# EAGLE design LumiDrive (EAGLE 9.2.1)
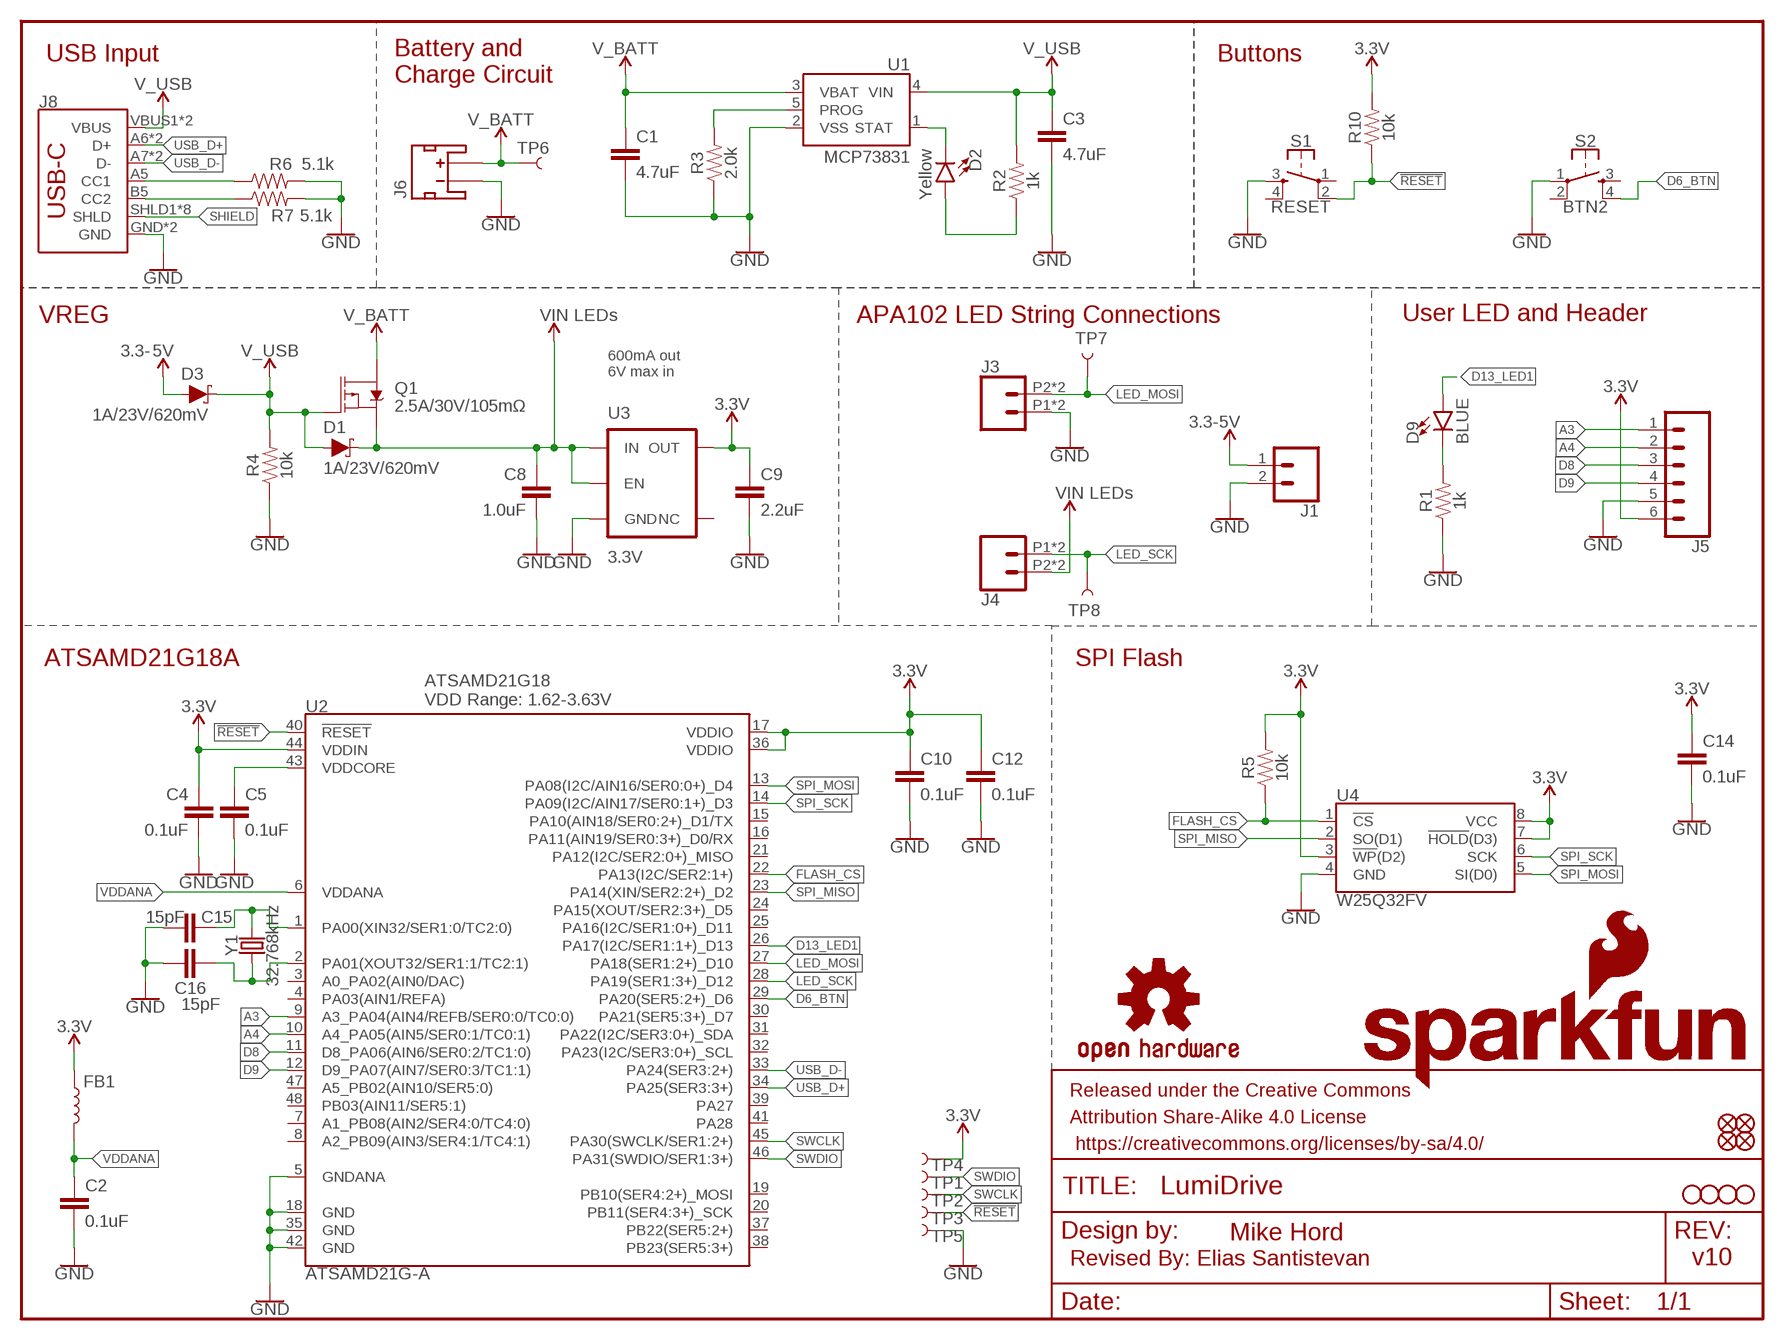
[diagram p0: schematic, sheet 1]

## Parts
C1  4.7uF  4.7UF-0603-6.3V-(10%)  [0603]
C2  0.1uF  0.1UF-0603-25V-(+80/-20%)  [0603]
C3  4.7uF  4.7UF-0603-6.3V-(10%)  [0603]
C4  0.1uF  0.1UF-0603-25V-(+80/-20%)  [0603]
C5  0.1uF  0.1UF-0603-25V-(+80/-20%)  [0603]
C8  1.0uF  1.0UF-0805-25V-10%  [0805]
C9  2.2uF  2.2UF-0603-10V-20%  [0603]
C10  0.1uF  0.1UF-0603-25V-(+80/-20%)  [0603]
C12  0.1uF  0.1UF-0603-25V-(+80/-20%)  [0603]
C14  0.1uF  0.1UF-0603-25V-(+80/-20%)  [0603]
C15  15pF  15PF-0603-50V-5%  [0603]
C16  15pF  15PF-0603-50V-5%  [0603]
D1  1A/23V/620mV  DIODE-SCHOTTKY-BAT20J  [SOD-323]
D2  Yellow  LED-YELLOW0603  [LED-0603]
D3  1A/23V/620mV  DIODE-SCHOTTKY-BAT20J  [SOD-323]
D9  BLUE  LED-BLUE0603  [LED-0603]
FB1  30Ω/1.8A  INDUCTORFB-30OHM  [0603]
FD1  FIDUCIALUFIDUCIAL  [FIDUCIAL-MICRO]
FD2  FIDUCIALUFIDUCIAL  [FIDUCIAL-MICRO]
FD3  FIDUCIALUFIDUCIAL  [FIDUCIAL-MICRO]
FD4  FIDUCIALUFIDUCIAL  [FIDUCIAL-MICRO]
FRAME1  FRAME-LETTER  [CREATIVE_COMMONS]
H1  STAND-OFF  [STAND-OFF]
H2  STAND-OFF  [STAND-OFF]
H3  STAND-OFF  [STAND-OFF]
H4  STAND-OFF  [STAND-OFF]
J1  CONN_021X02_NO_SILK  [1X02_NO_SILK]
J3  CONN_02SMALL_POKEHOME  [1X02_POKEHOME]
J4  CONN_02SMALL_POKEHOME  [1X02_POKEHOME]
J5  CONN_06NO_SILK_FEMALE_PTH  [1X06_NO_SILK]
J6  JST_2MM_MALE  [JST-2-SMD]
J8  USB_C16PIN  [USB-C-16P]
LOGO1  OSHW-LOGOM  [OSHW-LOGO-M]
LOGO3  SFE_LOGO_NAME_FLAME.2_INCH  [SFE_LOGO_NAME_FLAME_.2]
Q1  2.5A/30V/105mΩ  MOSFET_PCH-DMG2307L  [SOT23-3]
R1  1k  1KOHM-0603-1/10W-1%  [0603]
R2  1k  1KOHM-0603-1/10W-1%  [0603]
R3  2.0k  2.0KOHM-0603-1/10W-5%  [0603]
R4  10k  10KOHM-0603-1/10W-1%  [0603]
R5  10k  10KOHM-0603-1/10W-1%  [0603]
R6  5.1k  5.1KOHM5.1KOHM-0603-1/10W-1%  [0603]
R7  5.1k  5.1KOHM5.1KOHM-0603-1/10W-1%  [0603]
R10  10k  10KOHM-0603-1/10W-1%  [0603]
S1  RESET  MOMENTARY-SWITCH-SPST-2-SMD-4.6X2.8MM  [TACTILE_SWITCH_SMD_4.6X2.8MM]
S2  BTN2  MOMENTARY-SWITCH-SPST-2-SMD-4.6X2.8MM  [TACTILE_SWITCH_SMD_4.6X2.8MM]
TP1  TP-SWDIO  TEST-POINT3X5  [PAD.03X.05]
TP2  TP-SWCLK  TEST-POINT3X5  [PAD.03X.05]
TP3  TP-!RESET!  TEST-POINT3X5  [PAD.03X.05]
TP4  TP-3.3V  TEST-POINT3X5  [PAD.03X.05]
TP5  TP-GND  TEST-POINT3X5  [PAD.03X.05]
TP6  TEST-POINT3X4  [PAD.03X.04]
TP7  TEST-POINT3X4  [PAD.03X.04]
TP8  TEST-POINT3X4  [PAD.03X.04]
U1  MCP73831  [SOT23-5]
U2  ATSAMD21G-A  [TQFP-48]
U3  3.3V  V_REG_AP2112K-3.3V  [SOT23-5]
U4  W25Q32FV  W25Q32FVSS  [SOIC-8]
Y1  32.768kHz  CRYSTAL-32.768KHZSMD-3.2X1.5  [CRYSTAL-SMD-3.2X1.5MM]

## Nets
3.3V: C4.1 C9.1 C10.1 C12.1 C14.1 FB1.1 J5.6 R5.2 R10.2 TP4.P$1 U2.17(VDDIO) U2.36(VDDIO) U2.44(VDDIN) U3.5(OUT) U4.3(!WP!(D2)) U4.7(!HOLD!(D3)) U4.8(VCC)
5V: D3.A J1.1
!RESET: R10.1 S1.2 TP3.P$1 U2.40(!RESET!)
A3: J5.1 U2.9(A3_PA04(AIN4/REFB/SER0:0/TC0:0))
A4: J5.2 U2.10(A4_PA05(AIN5/SER0:1/TC0:1))
D6_BTN: S2.4 U2.29(PA20(SER5:2+)_D6)
D8: J5.3 U2.11(D8_PA06(AIN6/SER0:2/TC1:0))
D9: J5.4 U2.12(D9_PA07(AIN7/SER0:3/TC1:1))
D13_LED1: D9.A U2.26(PA17(I2C/SER1:1+)_D13)
FLASH_CS: R5.1 U2.22(PA13(I2C/SER2:1+)) U4.1(!CS!)
GND: C1.2 C2.2 C3.2 C4.2 C5.2 C8.2 C9.2 C10.2 C12.2 C14.2 C15.1 C16.1 J1.2 J3.P1 J3.P3 J5.5 J6.1(-) J8.GND J8.GND2(GND) R1.1 R3.1 R4.1 R6.2 R7.2 S1.3 S2.1 TP5.P$1 U1.2(VSS) U2.5(GNDANA) U2.18(GND) U2.35(GND) U2.42(GND) U3.2(GND) U4.4(GND)
LED_MOSI: J3.P2 J3.P4 TP7.P$1 U2.27(PA18(SER1:2+)_D10)
LED_SCK: J4.P1 J4.P3 TP8.P$1 U2.28(PA19(SER1:3+)_D12)
N$1: D9.C R1.2
N$2: C15.2 U2.1(PA00(XIN32/SER1:0/TC2:0)) Y1.P$2
N$3: C16.2 U2.2(PA01(XOUT32/SER1:1/TC2:1)) Y1.P$1
N$4: D2.A R2.1
N$5: J8.B5(CC2) R7.1
N$6: J8.A5(CC1) R6.1
N$7: D2.C U1.1(STAT)
N$9: R3.2 U1.5(PROG)
SHIELD: J8.SHLD1(SHLD) J8.SHLD2(SHLD) J8.SHLD3(SHLD) J8.SHLD4(SHLD) J8.SHLD5(SHLD) J8.SHLD6(SHLD) J8.SHLD7(SHLD) J8.SHLD8(SHLD)
SPI_MISO: U2.23(PA14(XIN/SER2:2+)_D2) U4.2(SO(D1))
SPI_MOSI: U2.13(PA08(I2C/AIN16/SER0:0+)_D4) U4.5(SI(D0))
SPI_SCK: U2.14(PA09(I2C/AIN17/SER0:1+)_D3) U4.6(SCK)
SWCLK: TP2.P$1 U2.45(PA30(SWCLK/SER1:2+))
SWDIO: TP1.P$1 U2.46(PA31(SWDIO/SER1:3+))
USB_D+: J8.A6(D+) J8.B6(D+) U2.34(PA25(SER3:3+))
USB_D-: J8.A7(D-) J8.B7(D-) U2.33(PA24(SER3:2+))
V_BATT: C1.1 J6.2(+) Q1.3(D) TP6.P$1 U1.3(VBAT)
V_USB: C3.1 D1.A D3.C J8.VBUS1(VBUS) J8.VBUS2(VBUS) Q1.1(G) R2.2 R4.2 U1.4(VIN)
VDDANA: C2.1 FB1.2 U2.6(VDDANA)
VDDCORE: C5.1 U2.43(VDDCORE)
VIN: C8.1 D1.C J4.P2 J4.P4 Q1.2(S) U3.1(IN) U3.3(EN)
Unconnected: J6.NC1(PAD1) J6.NC2(PAD2) S1.1 S1.4 S2.2 S2.3 U2.3(A0_PA02(AIN0/DAC)) U2.4(PA03(AIN1/REFA)) U2.7(A1_PB08(AIN2/SER4:0/TC4:0)) U2.8(A2_PB09(AIN3/SER4:1/TC4:1)) U2.15(PA10(AIN18/SER0:2+)_D1/TX) U2.16(PA11(AIN19/SER0:3+)_D0/RX) U2.19(PB10(SER4:2+)_MOSI) U2.20(PB11(SER4:3+)_SCK) U2.21(PA12(I2C/SER2:0+)_MISO) U2.24(PA15(XOUT/SER2:3+)_D5) U2.25(PA16(I2C/SER1:0+)_D11) U2.30(PA21(SER5:3+)_D7) U2.31(PA22(I2C/SER3:0+)_SDA) U2.32(PA23(I2C/SER3:0+)_SCL) U2.37(PB22(SER5:2+)) U2.38(PB23(SER5:3+)) U2.39(PA27) U2.41(PA28) U2.47(A5_PB02(AIN10/SER5:0)) U2.48(PB03(AIN11/SER5:1)) U3.4(NC)

## Notes on the sheet
- Battery and
  Charge Circuit
- USB Input | Buttons
- VREG | APA102 LED String Connections | User LED and Header
- LEDs
- 3.3-
- 600mA out
  6V max in
- 3.3-
- LEDs
- ATSAMD21G18A | SPI Flash
- ATSAMD21G18
  VDD Range: 1.62-3.63V
- Mike Hord
- v10
- Revised By: Elias Santistevan

## Library data of the parts
C1 C3 = SparkFun-Capacitors:4.7UF: 4.7µF ceramic capacitors A capacitor is a passive two-terminal electrical component used to store electrical energy temporarily in an electric field.; PROD_ID: CAP-08280
C2 C4 C5 C10 C12 C14 = SparkFun-Capacitors:0.1UF: 0.1µF ceramic capacitors A capacitor is a passive two-terminal electrical component used to store electrical energy temporarily in an electric field.; PROD_ID: CAP-00810
C8 = SparkFun-Capacitors:1.0UF: 1µF ceramic capacitors A capacitor is a passive two-terminal electrical component used to store electrical energy temporarily in an electric field.; PROD_ID: CAP-08064
C9 = SparkFun-Capacitors:2.2UF: 2.2µF ceramic capacitors A capacitor is a passive two-terminal electrical component used to store electrical energy temporarily in an electric field.; PROD_ID: CAP-07888
C15 C16 = SparkFun-Capacitors:15PF: 15pF ceramic capacitors A capacitor is a passive two-terminal electrical component used to store electrical energy temporarily in an electric field.; PROD_ID: CAP-07881
D1 D3 = SparkFun-DiscreteSemi:DIODE-SCHOTTKY: Schottky diode A Schottky diode is a semiconductor diode which has a low forward voltage drop and a very fast switching action.; PROD_ID: DIO-11623
D2 = SparkFun-LED:LED-YELLOW: Yellow SMD LED Used in manufacturing several products at SparkFun. Packages: 0603 - SMD 0603 package[Product Link] <http://www.kingbrightusa.com/product.asp?catalog_name=LED&product_id=APT1608SYCK> 0603 -SMART - SMART SMD 0603 package (more efficient/more expensive) [Product Link] <http://www.osram-os.com/osram_os/en/products/product-catalog/led-light-emitting-diodes/smartled-0603/ly-l29k/index.jsp> LilyPad - SMD1206 package[Product Datasheet] <https://www.sparkfun.com/datasheets/DevTools/LilyPad/Q150YUS4.pdf> SparkFun Products: Blynk Board <https://www.sparkfun.com/products/13794> IOIO-OTG <https://www.sparkfun.com/products/13613> XBee Explorer Serial <https://www.sparkfun.com/products/13225>; PROD_ID: DIO-09003
D9 = SparkFun-LED:LED-BLUE: Blue SMD LED Used in manufacturing of various products at SparkFun Packages: 0603 - SMD 0603 package [Product Link] <http://www.digikey.com/product-detail/en/SMLE12BC7TT86/511-1589-2-ND/1641808> 1206 - SMD1206 package [Product Link] <http://www.digikey.com/product-detail/en/lite-on-inc/LTST-C150TBKT/160-1643-1-ND/573584> SparkFun Products: ESP8266 Thing-Dev Board <https://www.sparkfun.com/products/13711> RedBoard <https://www.sparkfun.com/products/12757>; PROD_ID: DIO-08575
FB1 = SparkFun-Coils:INDUCTOR: Inductors Resist changes in electrical current. Basically a coil of wire. SparkFun Products: SparkFun Load Cell Amplifier - HX711 <https://www.sparkfun.com/products/13879> IOIO-OTG - V2.2 <https://www.sparkfun.com/products/13613>; PROD_ID: NDUC-07859
FD1-FD4 = SparkFun-Aesthetics:FIDUCIAL: Fiducial Alignment Points Point-of-reference for pick-and-place machines and other optical instruments.
FRAME1 = SparkFun-Aesthetics:FRAME-LETTER: Schematic Frame - Letter Standard 8.5x11 US Letter frame
H1-H4 = SparkFun-Hardware:STAND-OFF: Stand Off Drill holes for mechanically mounting via screws, standoffs, etc. Note: Use the keepout ring to avoid running the screw head into surrounding components. Variant Overviews STAND-OFF - Mechanical footprint for a #4 phillips button head screw. STAND-OFF-TIGHT - Mechanical footprint for a #4 phillips button head screw, Example SparkFun Products Screw - Phillips Head (1/4", 4-40, 10 pack) <https://www.sparkfun.com/products/10453> (PRT-10453) Screw - Phillips Head (1/2", 4-40, 10 pack) <https://www.sparkfun.com/products/10452> (PRT-10452) Screw - Phillips Head (3/4", 4-40, 10 pack) <https://www.sparkfun.com/products/10451> (PRT-10451) Screw - Phillips Head (1", 4-40, 10 pack) <https://www.sparkfun.com/products/10450> (PRT-10450)
J1 = SparkFun-Connectors:CONN_02: Multi connection point. Often used as Generic Header-pin footprint for 0.1 inch spaced/style header connections On any of the 0.1 inch spaced packages, you can populate with these: Break Away Headers - Straight <https://www.sparkfun.com/products/116> (PRT-00116) Break Away Male Headers - Right Angle <https://www.sparkfun.com/products/553> (PRT-00553) Female Headers <https://www.sparkfun.com/products/115> (PRT-00115) Break Away Headers - Machine Pin <https://www.sparkfun.com/products/117> (PRT-00117) Break Away Female Headers - Swiss Machine Pin <https://www.sparkfun.com/products/743> (PRT-00743) For SCREWTERMINALS and SPRING TERMINALS visit here: Screw Terimnals on SparkFun.com <https://www.sparkfun.com/search/results?term=Screw+Terminals> (5mm/3.5mm/2.54mm spacing) This device is also useful as a general connection point to wire up your design to another part of your project. Our various solder wires solder well into these plated through hole pads. Hook-Up Wire - Assortment (Stranded, 22 AWG) <https://www.sparkfun.com/products/11375> (PRT-11375) Hook-Up Wire - Assortment (Solid Core, 22 AWG) <https://www.sparkfun.com/products/11367> (PRT-11367) View the entire wire category on our website here <https://www.sparkfun.com/categories/141> Special notes: Molex polarized connector foot print use with: PRT-08233 with associated crimp pins and housings. 2.54_SCREWTERM for use with PRT-10571. 3.5mm Screw Terminal footprints for PRT-08084 5mm Screw Terminal footprints for use with PRT-08432
J3 J4 = SparkFun-Connectors:CONN_02: Multi connection point. Often used as Generic Header-pin footprint for 0.1 inch spaced/style header connections On any of the 0.1 inch spaced packages, you can populate with these: Break Away Headers - Straight <https://www.sparkfun.com/products/116> (PRT-00116) Break Away Male Headers - Right Angle <https://www.sparkfun.com/products/553> (PRT-00553) Female Headers <https://www.sparkfun.com/products/115> (PRT-00115) Break Away Headers - Machine Pin <https://www.sparkfun.com/products/117> (PRT-00117) Break Away Female Headers - Swiss Machine Pin <https://www.sparkfun.com/products/743> (PRT-00743) For SCREWTERMINALS and SPRING TERMINALS visit here: Screw Terimnals on SparkFun.com <https://www.sparkfun.com/search/results?term=Screw+Terminals> (5mm/3.5mm/2.54mm spacing) This device is also useful as a general connection point to wire up your design to another part of your project. Our various solder wires solder well into these plated through hole pads. Hook-Up Wire - Assortment (Stranded, 22 AWG) <https://www.sparkfun.com/products/11375> (PRT-11375) Hook-Up Wire - Assortment (Solid Core, 22 AWG) <https://www.sparkfun.com/products/11367> (PRT-11367) View the entire wire category on our website here <https://www.sparkfun.com/categories/141> Special notes: Molex polarized connector foot print use with: PRT-08233 with associated crimp pins and housings. 2.54_SCREWTERM for use with PRT-10571. 3.5mm Screw Terminal footprints for PRT-08084 5mm Screw Terminal footprints for use with PRT-08432; PROD_ID: CONN-13512
J5 = SparkFun-Connectors:CONN_06: Multi connection point. Often used as Generic Header-pin footprint for 0.1 inch spaced/style header connections On any of the 0.1 inch spaced packages, you can populate with these: Break Away Headers - Straight <https://www.sparkfun.com/products/116> (PRT-00116) Break Away Male Headers - Right Angle <https://www.sparkfun.com/products/553> (PRT-00553) Female Headers <https://www.sparkfun.com/products/115> (PRT-00115) Break Away Headers - Machine Pin <https://www.sparkfun.com/products/117> (PRT-00117) Break Away Female Headers - Swiss Machine Pin <https://www.sparkfun.com/products/743> (PRT-00743) Arduino Stackable Header - 6 Pin <https://www.sparkfun.com/products/9280> (PRT-09280) For SCREWTERMINALS and SPRING TERMINALS visit here: Screw Terimnals on SparkFun.com <https://www.sparkfun.com/search/results?term=Screw+Terminals> (5mm/3.5mm/2.54mm spacing) This device is also useful as a general connection point to wire up your design to another part of your project. Our various solder wires solder well into these plated through hole pads. Hook-Up Wire - Assortment (Stranded, 22 AWG) <https://www.sparkfun.com/products/11375> (PRT-11375) Hook-Up Wire - Assortment (Solid Core, 22 AWG) <https://www.sparkfun.com/products/11367> (PRT-11367) View the entire wire category on our website here <https://www.sparkfun.com/categories/141>; PROD_ID: CONN-08437
J6 = SparkFun-Connectors:JST_2MM_MALE: JST 2MM MALE RA CONNECTOR Two pin, compact surface mount connector. Commonly used as a battery input connection point. We really like the solid locking feeling and high current rating on these small connectors. We use these all the time as battery connectors. Mates to single-cell LiPo batteries. Here is the connector we sell at SparkFun: JST Right Angle Connector - White <https://www.sparkfun.com/products/8612> (PRT-08612) Datasheet <http://www.sparkfun.com/datasheets/Prototyping/Connectors/JST-Horizontal.pdf> It was used on these SparkFun products: SparkFun MOSFET Power Controller <https://www.sparkfun.com/products/11214> (PRT-11214) SparkFun Battery Babysitter - LiPo Battery Manager <https://www.sparkfun.com/products/13777> (PRT-13777) And many, many others that required a lipo battery connection.; PROD_ID: CONN-11443; SF_ID: PRT-08612
J8 = SparkFun-Connectors:USB_C: USB Type C 16Pin Connector Super Speed pins not available on the 16-pin purely SMD connector so this part is best for USB 2.0 implementations. D1 and D2 are tied together enabling D+/- no matter which way the cable is plugged into the connector. The two channel configuration pins (CC1/2) are exposed. These are normally connected to ground via 5.1k resistors but can be reconfigured for high current/high power applications.; PROD_ID: CONN-14122
LOGO1 = SparkFun-Aesthetics:OSHW-LOGO: Open-Source Hardware (OSHW) Logo This logo indicates the piece of hardware it is found on incorporates a OSHW license and/or adheres to the definition of open source hardware found here: http://freedomdefined.org/OSHW
LOGO3 = SparkFun-Aesthetics:SFE_LOGO_NAME_FLAME: SparkFun Font Logo w/ Flame This is the SparkFun full logo. The logo on the schematic will always be the same size; the package variant is the height of the flame part of the logo. Default layer for the logo on the board is tSilk.
Q1 = SparkFun-DiscreteSemi:MOSFET_PCH: P-channel MOSFETs Voltage controlled devices that allow control of high current outputs. SparkFun Products: SparkFun ESP32 Thing <https://www.sparkfun.com/products/13907> SparkFun ESP8266 Thing <https://www.sparkfun.com/products/13231>; PROD_ID: TRANS-11308
R1 R2 = SparkFun-Resistors:1KOHM: 1kΩ resistor A resistor is a passive two-terminal electrical component that implements electrical resistance as a circuit element. Resistors act to reduce current flow, and, at the same time, act to lower voltage levels within circuits. - Wikipedia; PROD_ID: RES-07856
R3 = SparkFun-Resistors:2.0KOHM: 2kΩ resistor A resistor is a passive two-terminal electrical component that implements electrical resistance as a circuit element. Resistors act to reduce current flow, and, at the same time, act to lower voltage levels within circuits. - Wikipedia; PROD_ID: RES-08296
R4 R5 R10 = SparkFun-Resistors:10KOHM: 10kΩ resistor A resistor is a passive two-terminal electrical component that implements electrical resistance as a circuit element. Resistors act to reduce current flow, and, at the same time, act to lower voltage levels within circuits. - Wikipedia; PROD_ID: RES-00824
R6 R7 = SparkFun-Resistors:5.1KOHM; PROD_ID: RES-12083
S1 S2 = SparkFun-Switches:MOMENTARY-SWITCH-SPST-2: Momentary Switch (Pushbutton) - SPST - Two Circuits Normally-open (NO) SPST momentary switches (buttons, pushbuttons). Schematic symbol includes two switch circuits. Variants SMD-4.6MMX2.8MM - 4.60mm x 2.80mm Tactile Momentary Button Switch - Used on SparkFun SAMD21 Mini Breakout <https://www.sparkfun.com/products/13664> SMD-5.2MM - Mini Pushbutton Switch - SMD <https://www.sparkfun.com/products/8720> - Used on Arduino Pro Mini <https://www.sparkfun.com/products/11114>; PROD_ID: SWCH-13065
TP1-TP8 = SparkFun-Connectors:TEST-POINT: SparkFun Test Points Bare copper test points for troubleshooting or In-Circuit-Testing. These are used by our Production team for verifying production board runs using pogo-pins on test beds. SparkFun Products: SparkFun LSM9DS1 Breakout <https://www.sparkfun.com/products/13284> SparkFun PSOC <https://www.sparkfun.com/products/13714> SparkFun Load Cell Amplifier <https://www.sparkfun.com/products/13879>
U1 = SparkFun-IC-Power:MCP73831: MCP73831T Li-Ion, Li-Pol Controller Miniature single cell, fully integrated Li-Ion, Li-polymer charge management controller Datasheet <http://ww1.microchip.com/downloads/en/DeviceDoc/20001984g.pdf> SparkFun Products: SparkFun ESP32 Thing <https://www.sparkfun.com/products/13907> SparkFun 9DoF Razor IMU M0 <https://www.sparkfun.com/products/14001>; PROD_ID: IC-09995
U2 = SparkFun-IC-Microcontroller:ATSAMD21G: Atmel SAMD21G SMART ARM-Based Microcontroller The Atmel ® | SMART ™ SAM D21 is a series of low-power microcontrollers using the 32-bit ARM ® Cortex ® -M0+ processor, and ranging from 32- to 64-pins with up to 256KB Flash and 32KB of SRAM. The SAM D21 devices operate at a maximum frequency of 48MHz and reach 2.46 CoreMark/MHz. They are designed for simple and intuitive migration with identical peripheral modules, hex compatible code, identical linear address map and pin compatible migration paths between all devices in the product series. All devices include intelligent and flexible peripherals, Atmel Event System for inter-peripheral signaling, and support for capacitive touch button, slider and wheel user interfaces. Datasheet <https://cdn.sparkfun.com/datasheets/Dev/Arduino/Boards/Atmel-42181-SAM-D21_Datasheet.pdf> SparkFun Products SparkFun SAMD21 Mini Breakout <https://www.sparkfun.com/products/13664> (DEV-13664) SparkFun SAMD21 Dev Breakout <https://www.sparkfun.com/products/13672> (DEV-13672) (DEV-14926); PROD_ID: IC-13064
U3 = SparkFun-IC-Power:V_REG_AP2112: AP2112 - 600mA CMOS LDO Regulator w/ Enable The AP2112 is CMOS process low dropout linear regulator with enable function, the regulator delivers a guaranteed 600mA (min.) continuous load current. Features Output Voltage Accuracy: ±1.5% Output Current: 600mA (Min.) Foldback Short Current Protection: 50mA Enable Function to Turn ON/OFF VOUT Low Dropout Voltage (3.3V): 250mV (Typ.) @IOUT=600mA Excellent Load Regulation: 0.2%/A (Typ.) Excellent Line Regulation: 0.02%/V (Typ.) Low Quiescent Current: 55μA (Typ.) Low Standby Current: 0.01μA (Typ.) Low Output Noise: 50μVRMS PSRR: 100Hz -65dB, 1kHz -65dB OTSD Protection Stable with 1.0μF Flexible Cap: Ceramic, Tantalum and Aluminum Electrolytic Operation Temperature Range: -40°C to 85°C ESD: MM 400V, HBM 4000V; PROD_ID: VREG-12457
U4 = SparkFun-IC-Memory:W25Q32FV: W25Q32FV 32Mb (4MB) Serial Flash Memory The W25Q32FV support the standard Serial Peripheral Interface (SPI), Dual/Quad I/O SPI as well as 2-clocks instruction cycle Quad Peripheral Interface (QPI). 104MHz, SPI, 8-SOIC-EIAJ Datasheet <http://www.winbond.com/resource-files/w25q32fv%20revh%20091613.pdf> SparkFun Products SparkFun Blynk Board - ESP8266 <https://www.sparkfun.com/products/13794> (WRL-13794); PROD_ID: IC-13229
Y1 = SparkFun-Clocks:CRYSTAL-32.768KHZ: 32.768kHz Crystal Frequency: 32.768kHz Frequency Stability: ±20ppm Load Capacitance: 12.5pF (PTH-2X6 & SMD-3.2X1.5), 6pF (SMD-2X6) SparkFun Products: SparkFun BigTime Watch Kit <https://www.sparkfun.com/products/11734> SparkFun nRF52832 Breakout <https://www.sparkfun.com/products/13990> SparkFun Real Time Clock Module <https://www.sparkfun.com/products/12708>; PROD_ID: XTAL-13062

## Board
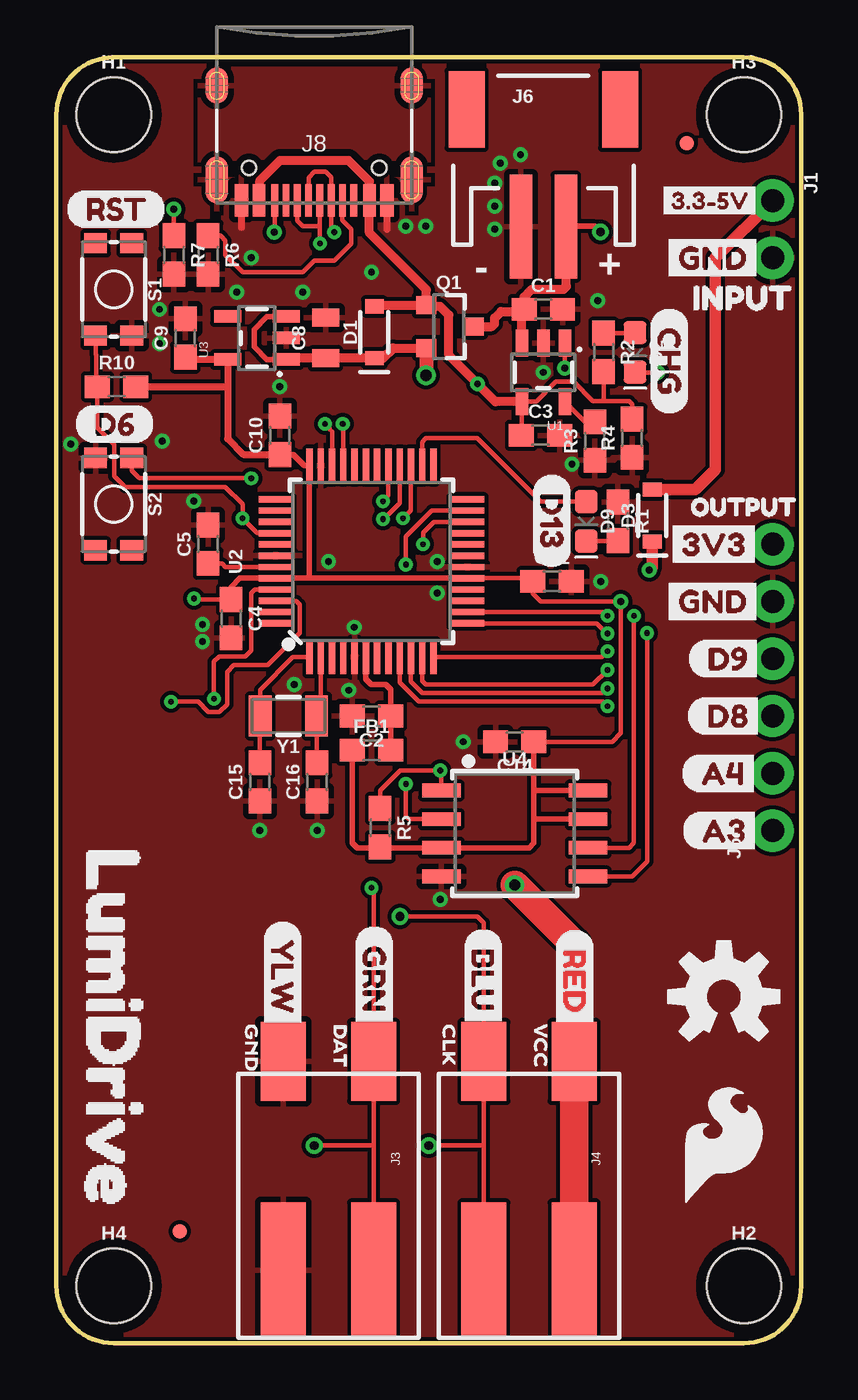
[diagram p1: board, top side]
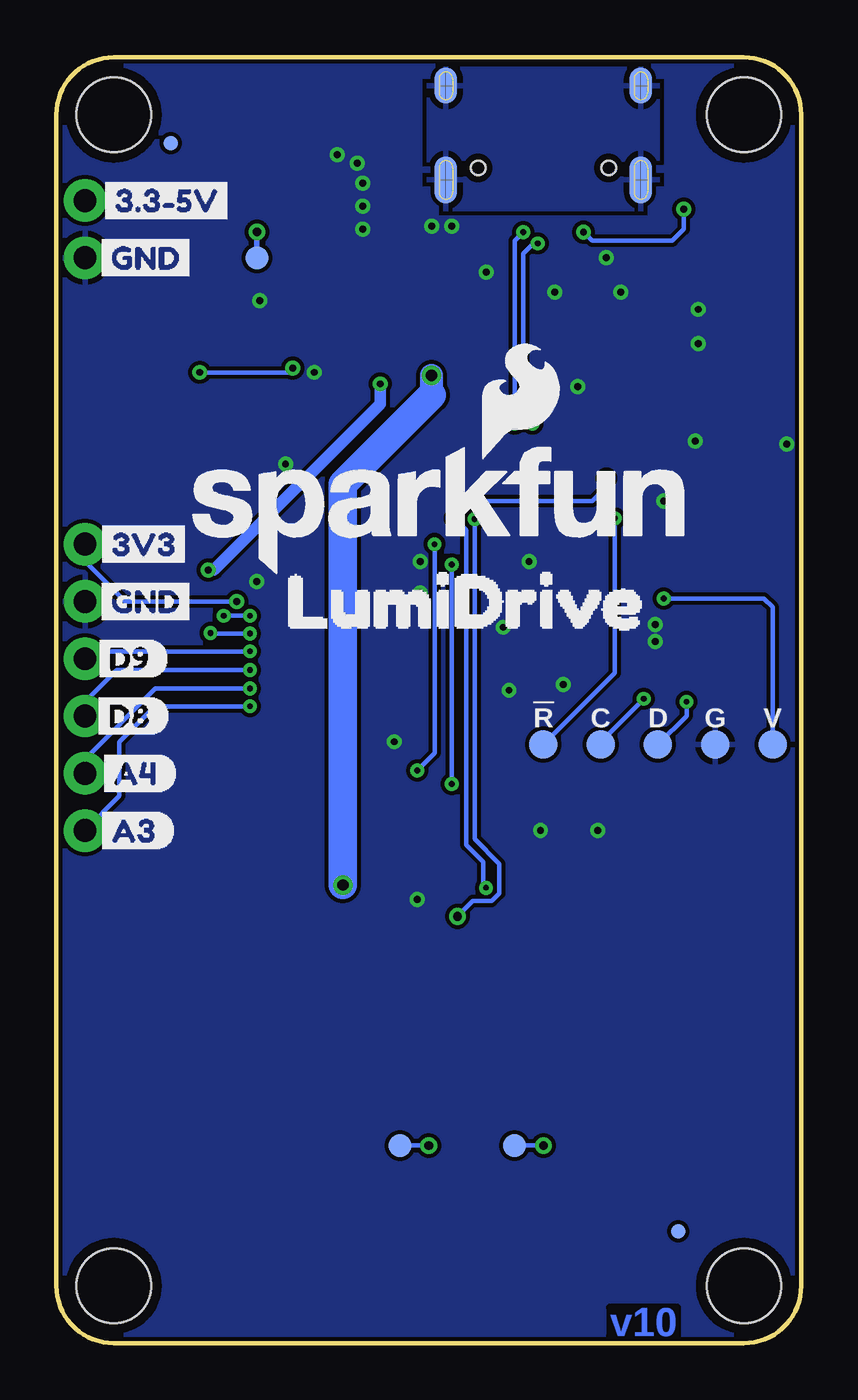
[diagram p2: board, bottom side, seen from below]

Size 33.02 x 57.02 mm. Coordinates in mm from the lower left corner, seen from the top.
Outline: 30.48,0 2.54,0 arc-90 0,2.54 0,54.48 arc-90 2.54,57.02 30.48,57.02 arc-90 33.02,54.48 33.02,2.54 arc-90 30.48,0
Copper layers (1*16): Top 0.035mm / dielectric 1.5mm / Bottom 0.035mm
Design rules "SparkFun-2-layer-TIGHT": minimum track width 7mil, minimum drill 15mil, track to track 7mil, track to pad 7mil, pad to pad 7mil, via to via 7mil, smd to smd 7mil, copper to edge 7mil, drill to drill 7mil, minimum pad ring 7mil, minimum via ring 7mil, stop-mask expansion 4mil, vias tented up to drill 25mil, thermal gap 10mil

### Footprints (pad centres in the part's own frame; a part is rotated, then mirrored left to right if it is on the bottom)
0603 = smd 1.1 x 1: 1 -0.85,0; 2 0.85,0
0805 = smd 0.8 x 1.2: 1 -0.9,0; 2 0.9,0
SOD-323 = smd 0.63 x 0.83: A 1.15,0; C -1.15,0
LED-0603 = smd 1 x 1: A -0.877,0; C 0.877,0
FIDUCIAL-MICRO = smd 0.635 x 0.635: 1 0,0
STAND-OFF = hole 3.302: 0,0
1X02_NO_SILK = drill 1.016 pad 1.88: 1 0,0; 2 2.54,0
1X02_POKEHOME = smd 3.5 x 2: P1 5.25,2; P2 5.25,-2 | smd 6 x 2: P3 -4,2; P4 -4,-2
1X06_NO_SILK = drill 1.016 pad 1.88: 1 0,0; 2 2.54,0; 3 5.08,0; 4 7.62,0; 5 10.16,0; 6 12.7,0
JST-2-SMD = smd 1 x 4.6: 1 -1,-3.7; 2 1,-3.7 | smd 1.6 x 3.4: NC1 -3.4,1.5; NC2 3.4,1.5
USB-C-16P = smd 0.3 x 1.45: A5 -1.25,0; A6 -0.25,0; A7 0.25,0; A8 1.25,0; B5 1.75,0; B6 0.75,0; B7 -0.75,0; B8 -1.75,0 | smd 0.6 x 1.45: GND -3.225,0; GND2 3.225,0 | smd 1 x 2.1: SHLD1 -4.32,-0.915; SHLD2 4.32,-0.915 | smd 1 x 2.1 bottom: SHLD3 -4.32,-0.915; SHLD4 4.32,-0.915 | smd 1 x 1.6: SHLD5 -4.32,-5.095; SHLD8 4.32,-5.095 | smd 1 x 1.6 bottom: SHLD6 -4.32,-5.095; SHLD7 4.32,-5.095 | smd 0.55 x 1.45: VBUS1 -2.45,0; VBUS2 2.45,0 | hole 0.65: -2.89,-1.445; 2.89,-1.445
SOT23-3 = smd 0.8 x 0.9: 1 -0.95,-1; 2 0.95,-1; 3 0,1.1
TACTILE_SWITCH_SMD_4.6X2.8MM = smd 0.9 x 1: 1 -2.05,-0.8; 2 2.05,-0.8; 3 2.05,0.8; 4 -2.05,0.8
PAD.03X.05 = smd 1.27 x 1.27: P$1 0,0
PAD.03X.04 = smd 1.016 x 1.016: P$1 0,0
SOT23-5 = smd 0.55 x 1.2: 1 -0.95,-1.3; 2 0,-1.3; 3 0.95,-1.3; 4 0.95,1.3; 5 -0.95,1.3
TQFP-48 = smd 1.5 x 0.28: 1 -4.25,2.75; 2 -4.25,2.25; 3 -4.25,1.75; 4 -4.25,1.25; 5 -4.25,0.75; 6 -4.25,0.25; 7 -4.25,-0.25; 8 -4.25,-0.75; 9 -4.25,-1.25; 10 -4.25,-1.75; 11 -4.25,-2.25; 12 -4.25,-2.75; 25 4.25,-2.75; 26 4.25,-2.25; 27 4.25,-1.75; 28 4.25,-1.25; 29 4.25,-0.75; 30 4.25,-0.25; 31 4.25,0.25; 32 4.25,0.75; 33 4.25,1.25; 34 4.25,1.75; 35 4.25,2.25; 36 4.25,2.75 | smd 0.28 x 1.5: 13 -2.75,-4.25; 14 -2.25,-4.25; 15 -1.75,-4.25; 16 -1.25,-4.25; 17 -0.75,-4.25; 18 -0.25,-4.25; 19 0.25,-4.25; 20 0.75,-4.25; 21 1.25,-4.25; 22 1.75,-4.25; 23 2.25,-4.25; 24 2.75,-4.25; 37 2.75,4.25; 38 2.25,4.25; 39 1.75,4.25; 40 1.25,4.25; 41 0.75,4.25; 42 0.25,4.25; 43 -0.25,4.25; 44 -0.75,4.25; 45 -1.25,4.25; 46 -1.75,4.25; 47 -2.25,4.25; 48 -2.75,4.25
SOIC-8 = smd 0.61 x 1.702: 1 -1.905,-3.251; 2 -0.635,-3.251; 3 0.635,-3.251; 4 1.905,-3.251; 5 1.905,3.251; 6 0.635,3.251; 7 -0.635,3.251; 8 -1.905,3.251
CRYSTAL-SMD-3.2X1.5MM = smd 1 x 1.8: P$1 -1.25,0; P$2 1.25,0

### Placement (x,y rotation side)
C1  21.59,45.85 0 top
C2  13.97,27.81 180 top
C3  21.46,40.26 0 top
C4  7.75,32.13 270 top
C5  6.73,35.43 90 top
C8  11.94,44.58 90 top
C9  5.71,44.58 90 top
C10  9.91,40.26 90 top
C12  21.97,33.78 0 top
C14  20.32,26.67 180 top
C15  9.02,24.89 90 top
C16  11.56,24.89 90 top
D1  14.1,44.83 90 top
D2  25.65,43.94 270 top
D3  26.42,36.7 90 top
D9  23.5,36.45 270 top
FB1  13.97,26.29 0 top
FD1  27.94,53.21 0 top
FD2  5.46,4.95 0 top
FD3  27.94,53.21 0 bottom
FD4  5.46,4.95 0 bottom
FRAME1  -3.81,-19.05 0 top  (outside the outline)
H1  2.54,54.48 0 top
H2  30.48,2.54 0 top
H3  30.48,54.48 0 top
H4  2.54,2.54 0 top
J1  31.75,50.67 270 top
J3  12.06,7.24 90 top
J4  20.95,7.24 90 top
J5  31.75,22.73 90 top
J6  21.59,53.21 0 top
J8  11.43,50.67 180 top
LOGO1  29.59,15.37 0 top
LOGO3  16,36.96 0 bottom
Q1  17.4,45.09 270 top
R1  24.89,36.45 270 top
R2  24.26,43.94 270 top
R3  23.88,40.01 90 top
R4  25.53,40.13 90 top
R5  14.35,22.86 270 top
R6  6.73,48.26 270 top
R7  5.21,48.26 270 top
R10  2.67,42.42 0 top
S1  2.54,46.74 270 top
S2  2.54,37.21 270 top
TP1  6.35,26.54 0 bottom
TP2  8.89,26.54 0 bottom
TP3  11.43,26.54 0 bottom
TP4  1.27,26.54 0 bottom
TP5  3.81,26.54 0 bottom
TP6  24.13,48.13 0 bottom
TP7  12.7,8.76 0 bottom
TP8  17.78,8.76 0 bottom
U1  21.59,43.05 180 top
U2  13.97,34.67 90 top
U3  8.89,44.58 90 top
U4  20.32,22.61 270 top
U$1  [GND-04]  26.67,32.89 0 top
U$2  [GRN0]  14.1,18.54 270 top
U$3  [BLU0]  18.92,18.41 270 top
U$4  [YLW0]  10.03,18.8 270 top
U$5  [GND-04]  31.5,32.89 0 bottom
U$6  [LUMIDRIVE0]  2.54,24 270 top
U$8  [3#3#5V0]  31.37,50.67 0 bottom
U$9  [INPUT0]  27.3,46.35 0 top
U$10  [RED0]  22.99,18.41 270 top
U$11  [RST0]  0.38,50.29 0 top
U$12  [D60]  0.76,40.77 0 top
U$13  [CLK1]  17.4,14.61 270 top
U$14  [DAT2]  12.57,14.61 270 top
U$15  [GND0]  8.64,14.61 270 top
U$16  [VCC3]  21.46,14.61 270 top
U$17  [CHG0]  27.18,45.97 270 top
U$18  [D130]  21.97,38.61 270 top
U$19  [GND-04]  26.67,48.13 0 top
U$20  [3V3-04]  26.8,35.43 0 top
U$21  [D90]  27.94,30.35 0 top
U$22  [D80]  27.94,27.81 0 top
U$23  [A40]  27.69,25.27 0 top
U$24  [A30]  27.69,22.73 0 top
U$25  [OUTPUT0]  27.43,37.08 0 top
U$26  [GND-04]  31.5,48.13 0 bottom
U$27  [3V3-04]  31.5,35.43 0 bottom
U$28  [SFE_LOGO_FLAME_.2]  29.59,8.76 0 top
U$29  [3#3#5V0]  26.54,50.67 0 top
U$37  [A30]  31.5,22.73 0 bottom
U$38  [A40]  31.37,25.27 0 bottom
U$39  [D80]  31.62,27.81 0 bottom
U$40  [D90]  31.62,30.35 0 bottom
U$41  [LUMIDRIVE0]  24.89,32.89 0 bottom
Y1  10.29,27.81 180 top

### Tracks (layer width: path | path; a pad name or v marks a point on that pad's centre or on a via)
3.3V  (via drill 0.25, 0.3)
  Top 0.203: 11.22,33.97 11.18,33.92 | C4.1 6.13,32.98 v6.1,33.02 | U2.17 20.98,33.92 C12.1 21.12,33.23 21.46,32.89 v25.02,32.89 25.02,27.05 24.64,26.67 C14.1
  Top 0.254: C4.1 7.75,33.53 8.14,33.92 U2.44 11.18,33.92 U2.17 | C10.1 10.5,39.41 10.99,38.92 U2.36 11.22,33.97 | C14.1 21.17,24.51 | 21.17,24.51 21.17,23.24 | 21.17,23.24 21.17,22.19 20.95,21.97 U4.3 14.31,21.97 | U4.7 21.17,23.24 | U4.8 21.17,24.51 | 14.31,21.97 13.34,21.97 13.12,22.19 FB1.1 | 14.31,21.97 R5.2 | C9.1 5.89,43.9
  Top 0.305: 8.29,39.41 C10.1 8.29,39.41 | 7.59,42.42 7.59,40.11 | 7.59,40.11 8.29,39.41 | R10.2 7.59,42.42 | 7.59,42.42 U3.5 6.16,43.63 5.89,43.9 | 7.59,40.11 8.29,39.41
  Bottom 0.203: v6.1,33.02 1.65,33.02 1.27,32.64 TP4.P$1 | v25.02,32.89 29.97,32.89 31.75,34.67 J5.6
5V
  Top 0.508: D3.A 28.32,37.85 29.21,38.74 29.21,48.13 J1.1
!RESET  (via drill 0.25)
  Top 0.203: S1.2 1.74,43.85 1.78,43.81 1.78,42.46 R10.1 1.82,40.6 2.56,39.86 2.56,38.46 3.05,37.97 7.49,37.97 8.26,37.21 v8.26,36.58 8.91,35.92 U2.40
  Bottom 0.203: v8.26,36.58 8.26,29.72 TP3.P$1
A3  (via drill 0.25)
  Top 0.203: U2.9 15.22,29.3 16.07,28.45 24.23,28.45 v24.43,28.24
  Bottom 0.203: v24.43,28.24 28.65,28.24 30.23,26.67 30.23,24.26 J5.1
A4  (via drill 0.25)
  Top 0.203: U2.10 15.72,29.33 16.23,28.83 24.23,28.83 v24.43,29.03
  Bottom 0.203: v24.43,29.03 28.63,29.03 31.75,25.91 J5.2
D6_BTN  (via drill 0.25)
  Top 0.203: U2.29 14.72,37.58 v14.48,37.34 | v8.64,38.35 3.68,38.35 3.34,38.7 S2.4
  Bottom 0.203: v14.48,37.34 9.27,37.34 8.64,37.97 v8.64,38.35
D8  (via drill 0.25)
  Top 0.203: U2.11 16.22,29.37 16.38,29.21 23.79,29.21 v24.43,29.86
  Bottom 0.203: v24.43,29.86 30.34,29.86 31.75,28.45 J5.3
D9  (via drill 0.25)
  Top 0.203: U2.12 24.17,30.42 v24.43,30.68
  Bottom 0.203: v24.43,30.68 31.42,30.68 J5.4
D13_LED1
  Top 0.203: U2.26 16.22,39.97 16.38,40.13 18.67,40.13 21.48,37.33 D9.A
FLASH_CS  (via drill 0.25)
  Top 0.203: U2.22 16.74,36.42 16.26,35.94 v16.26,35.43 | R5.1 14.35,24.51 15.24,25.4 v17.02,25.4 17.07,25.35 U4.1
  Bottom 0.203: v16.26,35.43 16.26,26.16 v17.02,25.4
GND  (via drill 0.3)
  Top 0.305: J8.GND 14.65,49.4 | J8.GND2 8.21,49.48
  other vias: 16.89,33.27 22.86,38.99 16.89,34.67 19.68,52.32 19.43,51.44 19.43,50.42 19.43,49.4 11.56,22.73 9.02,22.73 10.54,29.21 13.21,31.75 21.59,43.05 6.48,31.88 6.48,31.11 6.1,37.34 18.03,26.67 17.02,19.68 20.57,52.7 15.49,49.53 8.64,48.13 12.95,28.96 4.57,45.85 24.13,33.78 10.92,46.61 12.06,34.67 16.38,49.53 9.91,42.42 0.64,39.88 4.7,40.01 4.57,44.32 24,46.23 13.97,47.5 8,46.61
  pour Top (isolate 0.178, rank 6): 0,57.02 0,0 33.02,0 33.02,57.02
  pour Bottom (isolate 0.178, rank 6): 33.02,57.02 33.02,0 0,0 0,57.02
LED_MOSI  (via drill 0.25, 0.38)
  Top 0.203: U2.27 15.72,36.93 v15.37,36.58 | v13.97,20.19 14.06,20.1 J3.P2 14.06,8.76 | 14.06,8.76 14.06,3.78 13.97,3.68 13.97,3.33 J3.P4 | v11.43,8.76 14.06,8.76
  Bottom 0.203: v15.37,36.58 14.86,36.07 14.86,22.1 14.1,21.34 14.1,20.32 v13.97,20.19 | TP7.P$1 v11.43,8.76
LED_SCK  (via drill 0.25, 0.38)
  Top 0.203: v14.48,36.55 14.68,36.75 14.72,36.75 15.22,37.25 U2.28 | v15.24,18.92 18.67,18.92 18.95,18.64 J4.P1 18.95,8.76 | 18.95,8.76 J4.P3 | 18.95,8.76 v16.51,8.76
  Bottom 0.203: v14.48,36.55 14.48,22.35 13.39,21.26 13.39,19.95 13.73,19.61 14.55,19.61 v15.24,18.92 | TP8.P$1 v16.51,8.76
N$1
  Top 0.203: R1.2 24.86,35.57 D9.C
N$2
  Top 0.203: U2.1 10.48,30.42 9.04,28.98 Y1.P$2 9.02,27.79 C15.2
N$3
  Top 0.203: U2.2 11.72,28 Y1.P$1 11.54,25.76 C16.2
N$4
  Top 0.203: D2.A 25.63,44.79 R2.1
N$5  (via drill 0.3)
  Top 0.203: J8.B5 9.68,49.3 v9.65,49.28 | v5.21,50.29 R7.1
  Bottom 0.203: v9.65,49.28 9.27,48.9 5.71,48.9 5.21,49.4 v5.21,50.29
N$6
  Top 0.203: J8.A5 12.68,49.8 13.08,49.4 13.08,48.77 12.32,48.01 11.43,48.01 10.92,47.5 8.26,47.5 7.49,48.26 7.49,48.9 7.28,49.11 R6.1
N$7  (via drill 0.3)
  Top 0.203: U1.1 v22.54,43.25 | D2.C 25.67,43.05 v26.67,43.05
  Bottom 0.203: v26.67,43.05 22.73,43.05 v22.54,43.25
N$9
  Top 0.203: U1.5 23.44,40.85 R3.2
SHIELD
  pour Top (isolate 0.305): 6.35,57.02 6.35,50.29 16.51,50.29 16.51,57.02
  pour Bottom (isolate 0.305): 6.35,57.02 6.35,50.29 16.51,50.29 16.51,57.02
SPI_MISO  (via drill 0.25)
  Top 0.203: v15.49,34.53 15.49,35.77 16.64,36.92 U2.23 | U4.2 15.62,23.24 15.49,23.37 v15.49,24.8
  Bottom 0.203: v15.49,24.8 v15.49,34.53
SPI_MOSI  (via drill 0.25)
  Top 0.203: U4.5 25.53,20.7 26.19,21.36 v26.19,31.5 | U2.13 23.95,31.92 24.19,31.67 24.23,31.67 v24.43,31.47
  Bottom 0.203: v24.43,31.47 26.16,31.47 v26.19,31.5
SPI_SCK  (via drill 0.25)
  Top 0.203: U2.14 24.27,32.42 v24.43,32.26 | v25.6,32.26 25.6,22.17 25.4,21.97 U4.6
  Bottom 0.203: v24.43,32.26 v25.6,32.26
SWCLK  (via drill 0.25)
  Top 0.203: U2.45 8.78,33.42 8.64,33.27 8.64,30.73 8.36,30.45 7.21,30.45 6.99,30.23 v6.99,28.57
  Bottom 0.203: v6.99,28.57 8.89,26.67 TP2.P$1
SWDIO  (via drill 0.25)
  Top 0.203: U2.46 10.64,32.92 10.79,32.77 10.79,31.5 9.37,30.07 7.87,30.07 7.57,29.77 7.57,28.33 7.23,27.99 6.74,27.99 6.29,28.45 v5.08,28.45
  Bottom 0.203: TP1.P$1 5.08,27.81 v5.08,28.45
USB_D+  (via drill 0.25)
  Top 0.203: U2.34 12.22,40.42 12.12,40.52 12.12,40.56 v11.91,40.77 | J8.A6 11.68,49.53 | 11.68,49.53 v11.68,48.77 | J8.B6 10.68,49.77 10.92,49.53 11.68,49.53
  Bottom 0.203: v11.68,48.77 11.87,48.77 12.32,48.32 12.32,41.21 12.12,41.01 12.12,40.97 v11.91,40.77
USB_D-  (via drill 0.25)
  Top 0.203: U2.33 12.72,40.75 v12.7,40.77 | v12.32,49.28 12.18,49.41 J8.B7 12.18,51.7 11.94,51.94 11.43,51.94 11.18,51.69 J8.A7
  Bottom 0.203: v12.32,49.28 12.7,48.9 v12.7,40.77
V_BATT  (via drill 0.38)
  Top 0.254: v24.13,49.28 23.88,49.53 22.61,49.53 J6.2
  Top 0.406: J6.2 22.61,49.5 22.61,46.86 22.48,46.74 21.08,46.74 20.74,46.39 C1.1 20.64,45.75 | U1.3 20.64,45.75 | Q1.3 19.3,45.09 19.43,45.21 19.43,45.47 19.71,45.75 20.64,45.75
  Bottom 0.254: v24.13,49.28 TP6.P$1
V_USB  (via drill 0.3)
  Top 0.203: 22.15,42.63 22.93,42.63 | 21.27,41.75 U1.4 20.64,40.29 C3.1 | 21.27,41.75 22.15,42.63 | 22.93,42.63 23.78,41.78 | 24.26,41.78 R2.2 | 23.78,41.78 24.26,41.78 | R4.2 25.53,41.66 25.4,41.78 24.26,41.78 | 22.93,42.63 23.78,41.78 | 21.27,41.75 22.15,42.63 | 22.15,42.63 22.93,42.63
  Top 0.406: 19.46,41.75 U1.4 19.46,41.75 | 19.46,41.75 v18.67,42.55 | v18.67,42.55 17.4,43.81 | J8.VBUS2 9.02,50.71 9.02,51.56 9.91,52.45 12.95,52.45 13.88,51.52 J8.VBUS1 13.88,49.24 16.4,46.72 Q1.1 | 17.4,43.81 17.4,45.59 17.02,45.97 16.46,45.97 Q1.1 | D1.A 14.15,46.03 Q1.1 | v18.67,42.55 17.4,43.81 | 19.46,41.75 v18.67,42.55
  Top 0.508: D3.C 26.42,34.42 v26.29,34.29
  Bottom 0.508: v26.29,34.29 26.04,34.29 18.67,41.66 v18.67,42.55
VDDANA
  Top 0.254: U2.6 13.72,29.46 13.97,29.21 14.61,29.21 14.82,29 C2.1 FB1.2
VDDCORE
  Top 0.203: U2.43 7.49,34.42 7.37,34.54 7.33,34.58 C5.1
VIN  (via drill 0.51)
  Top 0.254: U3.3 9.33,45.53 8.76,44.96 8.76,44.2 9.33,43.63 U3.1
  Top 0.406: Q1.2 14.93,44.13 14.47,43.68 D1.C C8.1 10.24,43.68 U3.1
  Top 0.61: Q1.2 16.4,42.94 v16.38,42.93
  Top 1.27: J4.P4 22.86,3.33 22.86,3.68 22.95,3.78 J4.P2 22.95,17.68 v20.32,20.32
  Bottom 1.016: 16.38,42.04 v16.38,42.93
  Bottom 1.27: v20.32,20.32 20.32,38.1 16.38,42.04

### Text on the board
Bottom: v10
tPlace: - | +
bPlace: V | G | D | C | !R!
Measures: Measurements in inches
tDocu: Mike Hord | Revised By: Elias Santistevan